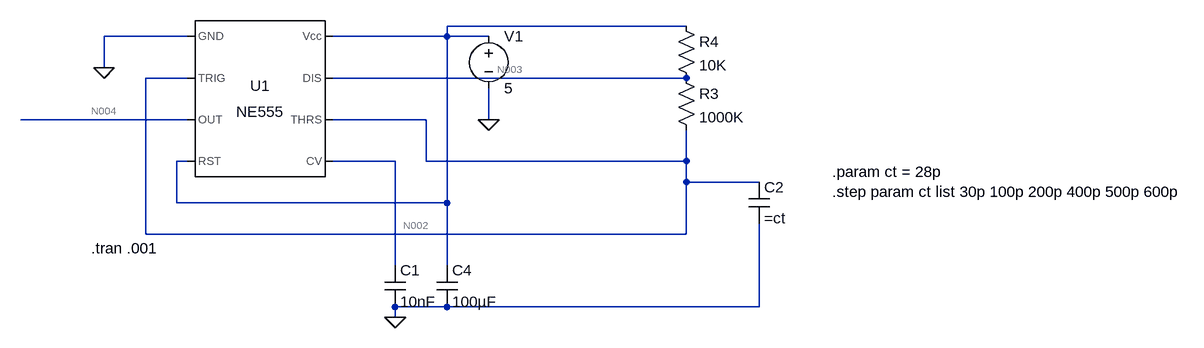
[diagram p0: schematic 555_freq.asc]
555_freq.asc, the LTspice schematic file:
Version 4
SHEET 1 1504 680
WIRE 688 64 320 64
WIRE -80 80 -208 80
WIRE 320 80 320 64
WIRE 320 80 144 80
WIRE 384 80 320 80
WIRE -208 128 -208 80
WIRE -80 144 -144 144
WIRE 688 144 144 144
WIRE -80 208 -336 208
WIRE 288 208 144 208
WIRE 384 208 384 160
WIRE -80 272 -96 272
WIRE 240 272 144 272
WIRE 288 272 288 208
WIRE 688 272 688 224
WIRE 688 272 288 272
WIRE 688 304 688 272
WIRE 800 304 688 304
WIRE -96 336 -96 272
WIRE 320 336 320 80
WIRE 320 336 -96 336
WIRE -144 384 -144 144
WIRE 688 384 688 304
WIRE 688 384 -144 384
WIRE 240 432 240 272
WIRE 320 432 320 336
WIRE 320 496 240 496
WIRE 800 496 800 368
WIRE 800 496 320 496
WIRE 240 512 240 496
FLAG -208 128 0
FLAG 384 208 0
FLAG 240 512 0
SYMBOL Misc\\NE555 32 176 R0
SYMATTR InstName U1
SYMBOL voltage 384 64 R0
WINDOW 123 0 0 Left 0
WINDOW 39 0 0 Left 0
SYMATTR InstName V1
SYMATTR Value 5
SYMBOL cap 224 432 R0
SYMATTR InstName C1
SYMATTR Value 10nF
SYMBOL cap 304 432 R0
SYMATTR InstName C4
SYMATTR Value 100µF
SYMBOL res 672 128 R0
SYMATTR InstName R3
SYMATTR Value 1000K
SYMBOL res 672 48 R0
SYMATTR InstName R4
SYMATTR Value 10K
SYMBOL cap 784 304 R0
SYMATTR InstName C2
SYMATTR Value =ct
TEXT -228 406 Left 2 !.tran .001
TEXT 912 288 Left 2 !.param ct = 28p\n.step param ct list 30p 100p 200p 400p 500p 600p

The netlist it stands for:
* 555_freq.asc
XU1 0 N002 N004 N001 N005 N002 N003 N001 NE555  ; pins GND TRIG OUT RST CV THRS DIS Vcc
V1 N001 0 5
C1 N005 0 10nF
C4 N001 0 100µF
R3 N003 N002 1000K
R4 N001 N003 10K
C2 N002 0 =ct
.tran .001
.param ct = 28p
.step param ct list 30p 100p 200p 400p 500p 600p
.lib NE555.sub
.backanno
.end

* Results of the author's LTspice run, read from the files saved beside the schematic
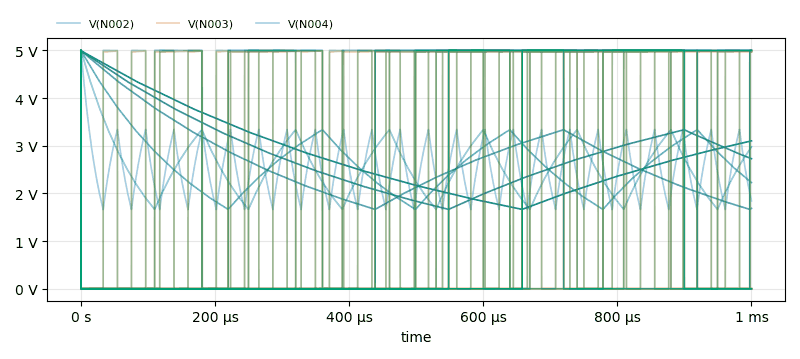
[diagram p1: Transient Analysis of 555_freq.asc, plotted from the saved traces]
* Transient Analysis, 6 runs:
*   V(N002) [run 1]: min 1.662 V, max 4.99 V, average 2.523 V, rms 2.58 V, last 1.844 V
*   V(N002) [run 2]: min 1.664 V, max 4.99 V, average 2.554 V, rms 2.623 V, last 2.978 V
*   V(N002) [run 3]: min 1.665 V, max 4.99 V, average 2.651 V, rms 2.733 V, last 2.226 V
*   V(N002) [run 4]: min 1.665 V, max 4.99 V, average 2.733 V, rms 2.846 V, last 1.686 V
*   V(N002) [run 5]: min 1.665 V, max 4.99 V, average 2.878 V, rms 2.989 V, last 2.729 V
*   V(N002) [run 6]: min 1.665 V, max 4.99 V, average 2.834 V, rms 2.965 V, last 3.102 V
*   V(N003) [run 1]: min 3.008 mV, max 5 V, average 2.434 V, rms 3.478 V, last 3.009 mV
*   V(N003) [run 2]: min 3.008 mV, max 5 V, average 2.357 V, rms 3.423 V, last 4.98 V
*   V(N003) [run 3]: min 3.008 mV, max 5 V, average 2.103 V, rms 3.233 V, last 3.012 mV
*   V(N003) [run 4]: min 3.008 mV, max 5 V, average 1.415 V, rms 2.651 V, last 4.967 V
*   V(N003) [run 5]: min 3.008 mV, max 5 V, average 1.752 V, rms 2.951 V, last 3.015 mV
*   V(N003) [run 6]: min 3.008 mV, max 5 V, average 1.704 V, rms 2.91 V, last 4.981 V
*   V(N004) [run 1]: min 30 µV, max 5 V, average 2.437 V, rms 3.49 V, last 30 µV
*   V(N004) [run 2]: min 30 µV, max 5 V, average 2.365 V, rms 3.438 V, last 5 V
*   V(N004) [run 3]: min 30 µV, max 5 V, average 2.11 V, rms 3.248 V, last 30 µV
*   V(N004) [run 4]: min 30 µV, max 5 V, average 1.419 V, rms 2.663 V, last 5 V
*   V(N004) [run 5]: min 30 µV, max 5 V, average 1.758 V, rms 2.964 V, last 30 µV
*   V(N004) [run 6]: min 30 µV, max 5 V, average 1.711 V, rms 2.925 V, last 5 V